# Altium schematic sheet iSystem-Mechanical.SchDoc
size A4; SheetNumber: 8; SheetTotal: 8
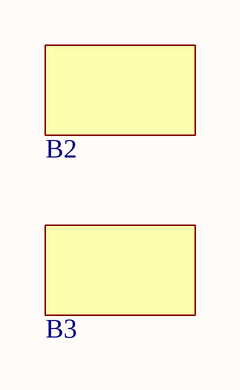
[diagram p0: iSystem-Mechanical.SchDoc]

## Parts
B2  BAT  [BAT]  (value not drawn)
B3  BAT  [BAT]  (value not drawn)